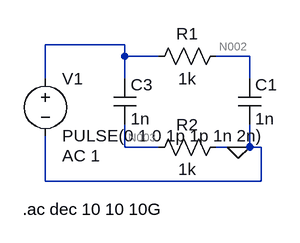
[diagram p0: schematic Draft10.asc]
Draft10.asc, the LTspice schematic file:
Version 4
SHEET 1 880 680
WIRE 64 96 -48 96
WIRE 64 112 64 96
WIRE 112 112 64 112
WIRE 240 112 192 112
WIRE -48 144 -48 96
WIRE 64 144 64 112
WIRE 240 144 240 112
WIRE 64 240 64 208
WIRE 112 240 64 240
WIRE 224 240 192 240
WIRE 240 240 240 208
WIRE 240 240 224 240
WIRE 256 240 240 240
WIRE -48 288 -48 224
WIRE 256 288 256 240
WIRE 256 288 -48 288
FLAG 224 240 0
SYMBOL res 208 96 R90
WINDOW 0 0 56 VBottom 2
WINDOW 3 32 56 VTop 2
SYMATTR InstName R1
SYMATTR Value 1k
SYMBOL res 208 224 R90
WINDOW 0 0 56 VBottom 2
WINDOW 3 32 56 VTop 2
SYMATTR InstName R2
SYMATTR Value 1k
SYMBOL cap 224 144 R0
SYMATTR InstName C1
SYMATTR Value 1n
SYMBOL cap 48 144 R0
SYMATTR InstName C3
SYMATTR Value 1n
SYMBOL voltage -48 128 R0
WINDOW 123 24 124 Left 2
WINDOW 39 0 0 Left 0
SYMATTR InstName V1
SYMATTR Value PULSE(0 1 0 1p 1p 1n 2n)
SYMATTR Value2 AC 1
TEXT -80 328 Left 2 !.ac dec 10 10 10G

The netlist it stands for:
* Draft10.asc
R1 N002 N001 1k
R2 0 N003 1k
C1 N002 0 1n
C3 N001 N003 1n
V1 N001 0 PULSE(0 1 0 1p 1p 1n 2n) AC 1
.ac dec 10 10 10G
.backanno
.end

* Results of the author's LTspice run, read from the files saved beside the schematic
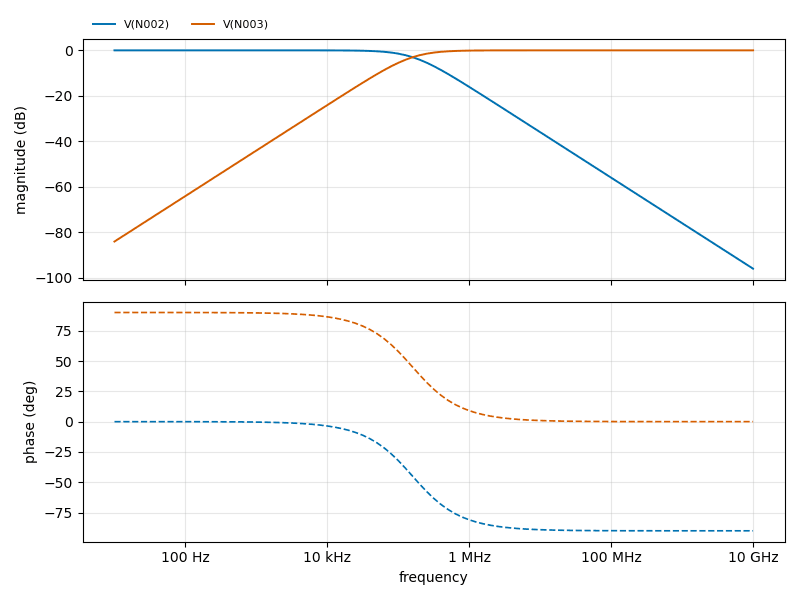
[diagram p1: AC Analysis of Draft10.asc, plotted from the saved traces]
* AC Analysis, 1 run:
*   V(N002): -0.00 dB at 10 Hz, -95.96 dB at 10 GHz, peak -0.00 dB at 10 Hz, 3 dB below the peak at 159.1 kHz
*   V(N003): -84.04 dB at 10 Hz, -0.00 dB at 10 GHz, peak -0.00 dB at 10 GHz, 3 dB below the peak at 159.2 kHz